# Altium schematic sheet Acoustic recorder.SchDoc
size A3; Organization: University of Manchester; SheetNumber: 1; SheetTotal: 1
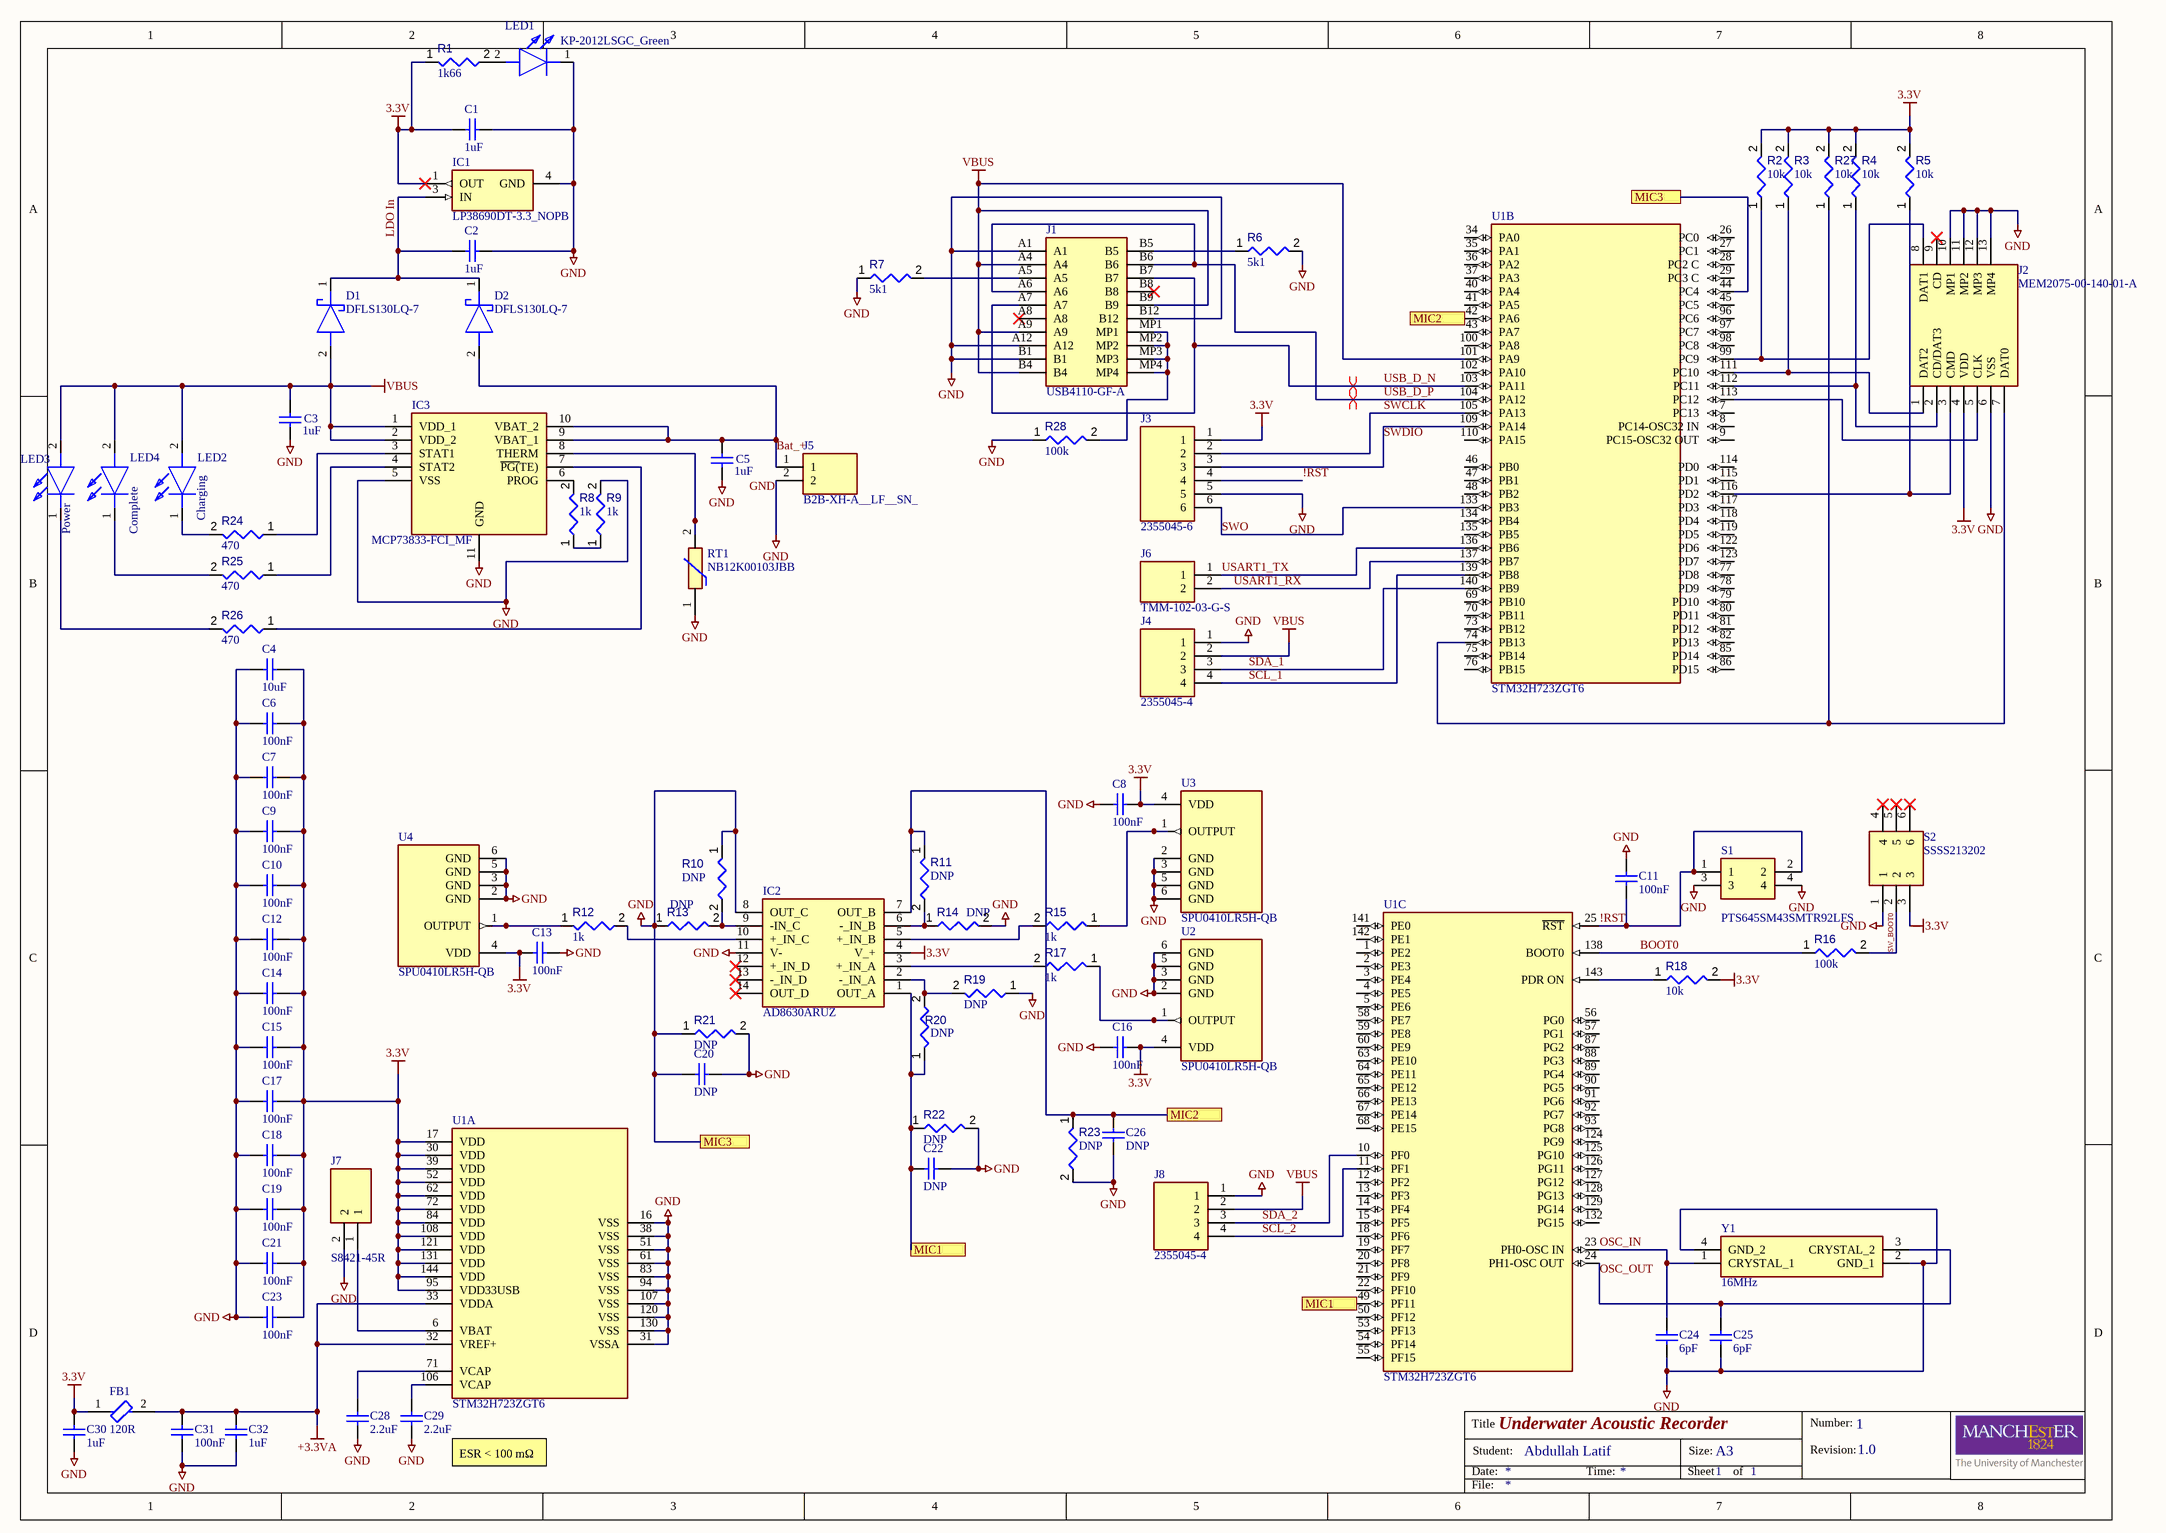
[diagram p0: Acoustic recorder.SchDoc]

## Parts
C1  1uF  [CAPC2013X145X50LL20T25]
C2  1uF  [CAPC2013X145X50LL20T25]
C3  1uF  [CAPC2013X145X50LL20T25]
C4  10uF  [CAPC2013X145X50LL20T25]
C5  1uF  [CAPC2013X145X50LL20T25]
C6  100nF  [CAPC2013X145X50LL20T25]
C7  100nF  [CAPC2013X145X50LL20T25]
C8  100nF  [CAPC2013X145X50LL20T25]
C9  100nF  [CAPC2013X145X50LL20T25]
C10  100nF  [CAPC2013X145X50LL20T25]
C11  100nF  [CAPC2013X145X50LL20T25]
C12  100nF  [CAPC2013X145X50LL20T25]
C13  100nF  [CAPC2013X145X50LL20T25]
C14  100nF  [CAPC2013X145X50LL20T25]
C15  100nF  [CAPC2013X145X50LL20T25]
C16  100nF  [CAPC2013X145X50LL20T25]
C17  100nF  [CAPC2013X145X50LL20T25]
C18  100nF  [CAPC2013X145X50LL20T25]
C19  100nF  [CAPC2013X145X50LL20T25]
C20  DNP  [CAPC2013X145X50LL20T25]
C21  100nF  [CAPC2013X145X50LL20T25]
C22  DNP  [CAPC2013X145X50LL20T25]
C23  100nF  [CAPC2013X145X50LL20T25]
C24  6pF  [CAPC2013X145X50LL20T25]
C25  6pF  [CAPC2013X145X50LL20T25]
C26  DNP  [CAPC2013X145X50LL20T25]
C28  2.2uF  [CAPC2013X145X50LL20T25]
C29  2.2uF  [CAPC2013X145X50LL20T25]
C30  1uF  [CAPC2013X145X50LL20T25]
C31  100nF  [CAPC2013X145X50LL20T25]
C32  1uF  [CAPC2013X145X50LL20T25]
D1  DFLS130LQ-7  [DFLS130LQ7]
D2  DFLS130LQ-7  [DFLS130LQ7]
FB1  120R  [FP-BLM21-0_2-t0_85-e0_5-IPC_A]
IC1  LP38690DT-3.3_NOPB  [TO228P991X238-3N]
IC2  AD8630ARUZ  [SOP65P640X120-14N]
IC3  MCP73833-FCI_MF  [SON50P300X300X100-11N-D]
J1  USB4110-GF-A  [USB4110GFA]
J2  MEM2075-00-140-01-A  [MEM20750014001A]
J3  2355045-6  [HDRV6W50P0X200_1X6_1200X200X550P]
J4  2355045-4  [HDRV4W50P0X200_1X4_800X200X550P]
J5  B2B-XH-A__LF__SN_  [SHDR2W64P0X250_1X2_740X575X700P]
J6  TMM-102-03-G-S  [HDRV2W50P0X200_1X2_400X197X550P]
J7  S8421-45R  [S8421-45R_1]
J8  2355045-4  [HDRV4W50P0X200_1X4_800X200X550P]
LED1  KP-2012LSGC_Green  [LEDC2012X110N]
LED2  Charging  [LEDC2012X110N]
LED3  Power  [LEDC2012X110N]
LED4  Complete  [LEDC2012X110N]
R1  1k66  [RESC2013X50X35ML15T15]
R2  value 10k  [RESC2013X50X35ML15T15]  (hidden comment: Resistor 10k +/-1% 0805 125 mW)
R3  value 10k  [RESC2013X50X35ML15T15]  (hidden comment: Resistor 10k +/-1% 0805 125 mW)
R4  value 10k  [RESC2013X50X35ML15T15]  (hidden comment: Resistor 10k +/-1% 0805 125 mW)
R5  value 10k  [RESC2013X50X35ML15T15]  (hidden comment: Resistor 10k +/-1% 0805 125 mW)
R6  5k1  [RESC2013X50X35ML15T15]
R7  5k1  [RESC2013X50X35ML15T15]
R8  1k  [RESC2013X50X35ML15T15]
R9  1k  [RESC2013X50X35ML15T15]
R10  DNP  [RESC2013X50X35ML15T15]
R11  DNP  [RESC2013X50X35ML15T15]
R12  1k  [RESC2013X50X35ML15T15]
R13  DNP  [RESC2013X50X35ML15T15]
R14  DNP  [RESC2013X50X35ML15T15]
R15  1k  [RESC2013X50X35ML15T15]
R16  100k  [RESC2013X50X35ML15T15]
R17  1k  [RESC2013X50X35ML15T15]
R18  10k  [RESC2013X50X35ML15T15]
R19  DNP  [RESC2013X50X35ML15T15]
R20  DNP  [RESC2013X50X35ML15T15]
R21  DNP  [RESC2013X50X35ML15T15]
R22  DNP  [RESC2013X50X35ML15T15]
R23  DNP  [RESC2013X50X35ML15T15]
R24  value 470  [RESC2013X50X35ML15T15]  (hidden comment: 1k)
R25  value 470  [RESC2013X50X35ML15T15]  (hidden comment: 1k)
R26  value 470  [RESC2013X50X35ML15T15]  (hidden comment: 1k)
R27  value 10k  [RESC2013X50X35ML15T15]  (hidden comment: Resistor 10k +/-1% 0805 125 mW)
R28  100k  [RESC2013X50X35ML15T15]
RT1  NB12K00103JBB  [RESC2212X50N]
S1  PTS645SM43SMTR92LFS  [PTS645(SMT)]
S2  SSSS213202  [SSSS213202]
U1  STM32H723ZGT6  [FP-LQFP144-1A-IPC_A]  (parts A,B,C of 3)
U2  SPU0410LR5H-QB  [XDCR_SPU0410LR5H-QB]
U3  SPU0410LR5H-QB  [XDCR_SPU0410LR5H-QB]
U4  SPU0410LR5H-QB  [XDCR_SPU0410LR5H-QB]
Y1  16MHz  [CX3225SA16000D0PSTZ1]

## Ports
MIC1, MIC2, MIC3

## Nets
3.3V: C1.1 C4.1 C6.1 C7.1 C8.1 C9.1 C10.1 C12.1 C13.1 C14.1 C15.2 C16.1 C17.2 C18.2 C19.2 C21.2 C23.2 C30.2 FB1.1 IC1.1(OUT) IC2.4(V_+) J2.4(VDD) J3.1 R1.1 R2.2 R3.2 R4.2 R5.2 R18.2 R27.2 S2.3 U1.17(VDD) U1.30(VDD) U1.39(VDD) U1.52(VDD) U1.62(VDD) U1.72(VDD) U1.84(VDD) U1.95(VDD33USB) U1.108(VDD) U1.121(VDD) U1.131(VDD) U1.144(VDD) U2.4(VDD) U3.4(VDD) U4.4(VDD)
+3.3VA: C31.2 C32.2 FB1.2 U1.32(VREF+) U1.33(VDDA)
GND: C1.2 C2.2 C3.1 C4.2 C5.1 C6.2 C7.2 C8.2 C9.2 C10.2 C11.2 C12.2 C13.2 C14.2 C15.1 C16.2 C17.1 C18.1 C19.1 C20.1 C20.2 C21.1 C22.2 C23.1 C24.2 C25.1 C26.2 C28.1 C29.1 C30.1 C31.1 C32.1 IC1.4(GND) IC2.8(OUT_C) IC2.11(V-) IC3.5(VSS) IC3.11(GND) J1.A1 J1.A12 J1.B1 J1.B12 J2.6(VSS) J2.10(MP1) J2.11(MP2) J2.12(MP3) J2.13(MP4) J3.5 J4.1 J5.2 J7.2 J8.1 LED1.1(K) R6.2 R7.1 R9.2 R10.1 R13.1 R14.2 R19.1 R21.1 R21.2 R22.2 R23.2 R28.1 RT1.1 S1.3 S1.4 S2.1 U1.16(VSS) U1.31(VSSA) U1.38(VSS) U1.44(PC4) U1.51(VSS) U1.61(VSS) U1.83(VSS) U1.94(VSS) U1.107(VSS) U1.120(VSS) U1.130(VSS) U2.2(GND) U2.3(GND) U2.5(GND) U2.6(GND) U3.2(GND) U3.3(GND) U3.5(GND) U3.6(GND) U4.2(GND) U4.3(GND) U4.5(GND) U4.6(GND) Y1.2(GND_1) Y1.4(GND_2) ; port MIC3
VBUS: C3.2 D1.2(A) IC3.1(VDD_1) IC3.2(VDD_2) J1.A4 J1.A9 J1.B4 J1.B9 J4.2 J8.2 LED2.2(A) LED3.2(A) LED4.2(A) U1.101(PA9)
!RST: C11.1 J3.4 S1.1 S1.2 U1.25(~{RST})
Bat_+: C5.2 D2.2(A) IC3.9(VBAT_1) IC3.10(VBAT_2) J5.1
BOOT0: R16.1 U1.138(BOOT0)
LDO In: C2.1 D1.1(K) D2.1(K) IC1.3(IN)
MIC1: C22.1 IC2.1(OUT_A) R20.1 R22.1 U1.49(PF11) ; port MIC1
MIC2: C26.1 IC2.7(OUT_B) R11.1 R23.1 U1.42(PA6) ; port MIC2
OSC_IN: C24.1 U1.23(PH0-OSC_IN) Y1.1(CRYSTAL_1)
OSC_OUT: C25.2 U1.24(PH1-OSC_OUT) Y1.3(CRYSTAL_2)
SCL_1: J4.4 U1.139(PB8)
SCL_2: J8.4 U1.11(PF1)
SDA_1: J4.3 U1.140(PB9)
SDA_2: J8.3 U1.10(PF0)
SW_BOOT0: R16.2 S2.2
SWCLK: J3.2 U1.105(PA13)
SWDIO: J3.3 U1.109(PA14)
SWO: J3.6 U1.133(PB3)
USART1_RX: J6.2 U1.137(PB7)
USART1_TX: J6.1 U1.136(PB6)
USB_D_N: J1.A7 J1.B7 U1.103(PA11)
USB_D_P: J1.A6 J1.B6 U1.104(PA12)
NetC28_2: C28.2 U1.71(VCAP)
NetC29_2: C29.2 U1.106(VCAP)
NetIC2_2: IC2.2(-_IN_A) R19.2 R20.2
NetIC2_3: IC2.3(+_IN_A) R17.2
NetIC2_5: IC2.5(+_IN_B) R15.2
NetIC2_6: IC2.6(-_IN_B) R11.2 R14.1
NetIC2_9: IC2.9(-IN_C) R10.2 R13.2
NetIC2_10: IC2.10(+_IN_C) R12.2
NetIC3_3: IC3.3(STAT1) R24.1
NetIC3_4: IC3.4(STAT2) R25.1
NetIC3_6: IC3.6(PROG) R8.2
NetIC3_7: IC3.7(~{PG(}TE)) R26.1
NetIC3_8: IC3.8(THERM) RT1.2
NetJ1_A5: J1.A5 R7.2
NetJ1_B5: J1.B5 R6.1
NetJ1_MP1: J1.MP1 J1.MP2 J1.MP3 J1.MP4 R28.2
NetJ2_1: J2.1(DAT2) R3.1 U1.111(PC10)
NetJ2_2: J2.2(CD/DAT3) R4.1 U1.112(PC11)
NetJ2_3: J2.3(CMD) R5.1 U1.116(PD2)
NetJ2_5: J2.5(CLK) U1.113(PC12)
NetJ2_7: J2.7(DAT0) R27.1 U1.74(PB13)
NetJ2_8: J2.8(DAT1) R2.1 U1.99(PC9)
NetJ7_1: J7.1 U1.6(VBAT)
NetLED1_2: LED1.2(A) R1.2
NetLED2_1: LED2.1(K) R24.2
NetLED3_1: LED3.1(K) R26.2
NetLED4_1: LED4.1(K) R25.2
NetR8_1: R8.1 R9.1
NetR12_1: R12.1 U4.1(OUTPUT)
NetR15_1: R15.1 U3.1(OUTPUT)
NetR17_1: R17.1 U2.1(OUTPUT)
NetR18_1: R18.1 U1.143(PDR_ON)

Not connected (* = marked no-connect by the designer): IC2 12(+_IN_D)* 13(-_IN_D)* 14(OUT_D)*; J1 A8* B8*; J2 9(CD)*; S2 4* 5* 6*; U1 1(PE2) 2(PE3) 3(PE4) 4(PE5) 5(PE6) 7(PC13) 8(PC14-OSC32_IN) 9(PC15-OSC32_OUT) 12(PF2) 13(PF3) 14(PF4) 15(PF5) 18(PF6) 19(PF7) 20(PF8) 21(PF9) 22(PF10) 26(PC0) 27(PC1) 28(PC2_C) 29(PC3_C) 34(PA0) 35(PA1) 36(PA2) 37(PA3) 40(PA4) 41(PA5) 43(PA7) 45(PC5) 46(PB0) 47(PB1) 48(PB2) 50(PF12) 53(PF13) 54(PF14) 55(PF15) 56(PG0) 57(PG1) 58(PE7) 59(PE8) 60(PE9) 63(PE10) 64(PE11) 65(PE12) 66(PE13) 67(PE14) 68(PE15) 69(PB10) 70(PB11) 73(PB12) 75(PB14) 76(PB15) 77(PD8) 78(PD9) 79(PD10) 80(PD11) 81(PD12) 82(PD13) 85(PD14) 86(PD15) 87(PG2) 88(PG3) 89(PG4) 90(PG5) 91(PG6) 92(PG7) 93(PG8) 96(PC6) 97(PC7) 98(PC8) 100(PA8) 102(PA10) 110(PA15) 114(PD0) 115(PD1) 117(PD3) 118(PD4) 119(PD5) 122(PD6) 123(PD7) 124(PG9) 125(PG10) 126(PG11) 127(PG12) 128(PG13) 129(PG14) 132(PG15) 134(PB4) 135(PB5) 141(PE0) 142(PE1)

## Layout directives
differential pair: USB_D_N, USB_D_P

## Notes on the sheet
- ESR < 100 mΩ
- Title
- Date:
- Student:
- Underwater Acoustic Recorder
- Abdullah Latif
- Time:
- Sheet
- Size:
- A3
- of
- Revision:
- Number:
- 1
- 1.0
- File:
- Labels drawn without touching a wire or pin: GND

## Library data of the parts
C1-C26 C28-C32 = CMP-1036-04391-2: Manufacturer: Kemet; Part Number: C0805C104K9RACTU
D1 D2 = DFLS130LQ-7: Schottky Diode; Manufacturer_Name: Diodes Inc.; Datasheet Link: https://www.diodes.com/assets/Datasheets/DFLS130LQ.pdf; Height: 1mm; Manufacturer_Part_Number: DFLS130LQ-7; Mouser Part Number: 621-DFLS130LQ7; Mouser Price/Stock: https://www.mouser.co.uk/ProductDetail/Diodes-Incorporated/DFLS130LQ-7?qs=vkMqrgFpRahNwl6S9aozvQ%3D%3D; Arrow Part Number: DFLS130LQ-7; Arrow Price/Stock: https://www.arrow.com/en/products/dfls130lq-7/diodes-incorporated?region=nac
FB1 = CMP-0686-00716-3: FERRITE BEAD 120 OHM 0805 1LN; Number of Lines: 1; DC Resistance-Max: 100mR; Material: Steel; Max DC Current: 200mA; Shielding: Unshielded; Test Frequency: 100MHz; Current Rating: 800mA; Max Current Rating: 1A; Resistance: 150mR; Tolerance: 25%; Width: 1.25mm; Number of Circuits: 1; Military Standard: Not; Height: 0.85mm; Series: BLM21A; Min Operating Temperature: -55°C; DC Resistance (DCR): 100mR; Termination: SMD/SMT; Impedance: 120R; Core Material: Ferrite; REACH SVHC: No SVHC; Radiation Hardening: No; Max Operating Temperature: 125°C; Number of Pins: 2; Case/Package: 0805; Case Code (Imperial): 0805; Frequency: 100MHz; Depth: 1.25mm; Length: 2mm; DC Current: 200mA; Lead Free: Lead Free; Case Code (Metric): 2012; Package Quantity: 1; Packaging: Tape and Reel
IC1 = LP38690DT-3.3_NOPB: Integrated Circuit; Manufacturer_Name: Texas Instruments; Manufacturer_Part_Number: LP38690DT-3.3/NOPB; Datasheet Link: http://www.ti.com/lit/ds/symlink/lp38690.pdf; Height: 2.38mm; Mouser Part Number: 926-38690DT-3.3/NOPB; Mouser Price/Stock: https://www.mouser.co.uk/ProductDetail/Texas-Instruments/LP38690DT-3.3-NOPB?qs=1FNqv8aZn1RDCTlgvtVtOw%3D%3D; Arrow Part Number: LP38690DT-3.3/NOPB; Arrow Price/Stock: https://www.arrow.com/en/products/lp38690dt-3.3nopb/texas-instruments?region=nac
IC2 = AD8630ARUZ: Integrated Circuit; Manufacturer_Name: Analog Devices; Datasheet Link: https://datasheet.datasheetarchive.com/originals/distributors/Datasheets-4/DSA-69692.pdf; Height: 1.2mm; Manufacturer_Part_Number: AD8630ARUZ; Mouser Part Number: 584-AD8630ARUZ; Mouser Price/Stock: https://www.mouser.co.uk/ProductDetail/Analog-Devices/AD8630ARUZ?qs=%2FtpEQrCGXCy30ZKDJ2UEnQ%3D%3D; Arrow Part Number: AD8630ARUZ; Arrow Price/Stock: https://www.arrow.com/en/products/ad8630aruz/analog-devices?region=nac
IC3 = MCP73833-FCI_MF: Integrated Circuit; Manufacturer_Name: Microchip; Manufacturer_Part_Number: MCP73833-FCI/MF; Datasheet Link: https://datasheet.datasheetarchive.com/originals/distributors/SFDatasheet-4/sf-00090109.pdf; Height: 1mm; Mouser Part Number: 579-MCP73833-FCI/MF; Mouser Price/Stock: https://www.mouser.co.uk/ProductDetail/Microchip-Technology/MCP73833-FCI-MF?qs=jZi1jxfVU97QRtF2cSv2tQ%3D%3D; Arrow Part Number: MCP73833-FCI/MF; Arrow Price/Stock: https://www.arrow.com/en/products/mcp73833-fcimf/microchip-technology?region=nac
J1 = USB4110-GF-A: Connector; Manufacturer_Name: GCT (GLOBAL CONNECTOR TECHNOLOGY); Datasheet Link: https://gct.co/files/drawings/usb4110.pdf; Height: 3.26mm; Manufacturer_Part_Number: USB4110-GF-A; Mouser Part Number: 640-USB4110-GF-A; Mouser Price/Stock: https://www.mouser.co.uk/ProductDetail/GCT/USB4110-GF-A?qs=KUoIvG%2F9IlYiZvIXQjyJeA%3D%3D
J2 = MEM2075-00-140-01-A: Connector; Manufacturer_Name: GCT (GLOBAL CONNECTOR TECHNOLOGY); Datasheet Link: http://www.farnell.com/cad/2606866.pdf; Manufacturer_Part_Number: MEM2075-00-140-01-A; Mouser Part Number: 640-MEM20750014001A; Mouser Price/Stock: https://www.mouser.co.uk/ProductDetail/GCT/MEM2075-00-140-01-A?qs=KUoIvG%2F9IlZvfWpeERlq3Q%3D%3D
J3 = 2355045-6: Connector; Manufacturer_Name: TE Connectivity; Datasheet Link: https://www.te.com/commerce/DocumentDelivery/DDEController?Action=showdoc&DocId=Customer+Drawing%7F2355045%7FA%7Fpdf%7FEnglish%7FENG_CD_2355045_A.pdf%7F2355045-6; Height: 5.5mm; Manufacturer_Part_Number: 2355045-6; Mouser Part Number: 571-2355045-6; Mouser Price/Stock: https://www.mouser.co.uk/ProductDetail/TE-Connectivity/2355045-6?qs=Cb2nCFKsA8odbib%252BLADOfw%3D%3D; Arrow Part Number: 2355045-6; Arrow Price/Stock: https://www.arrow.com/en/products/2355045-6/te-connectivity?region=nac
J4 J8 = 2355045-4: Connector; Manufacturer_Name: TE Connectivity; Datasheet Link: https://www.te.com/commerce/DocumentDelivery/DDEController?Action=srchrtrv&DocNm=2355045&DocType=Customer+Drawing&DocLang=English&PartCntxt=2355045-4&DocFormat=pdf; Height: 5.5mm; Manufacturer_Part_Number: 2355045-4; Mouser Part Number: 571-2355045-4; Mouser Price/Stock: https://www.mouser.co.uk/ProductDetail/TE-Connectivity/2355045-4?qs=Cb2nCFKsA8pf%2FHFl8Qaczg%3D%3D; Arrow Part Number: 2355045-4; Arrow Price/Stock: https://www.arrow.com/en/products/2355045-4/te-connectivity?region=nac
J5 = B2B-XH-A__LF__SN_: Connector; Manufacturer_Name: JST (JAPAN SOLDERLESS TERMINALS); Manufacturer_Part_Number: B2B-XH-A (LF)(SN); Datasheet Link: http://www.farnell.com/datasheets/5448.pdf; Height: 7mm
J6 = TMM-102-03-G-S: Connector; Manufacturer_Name: SAMTEC; Datasheet Link: https://www.arrow.com/en/products/tmm-102-03-g-s/samtec; Height: 5.5mm; Manufacturer_Part_Number: TMM-102-03-G-S; Mouser Part Number: 200-TMM10203GS; Mouser Price/Stock: https://www.mouser.co.uk/ProductDetail/Samtec/TMM-102-03-G-S?qs=iT52DjcXudtI9IbXWd2erQ%3D%3D; Arrow Part Number: TMM-102-03-G-S; Arrow Price/Stock: https://www.arrow.com/en/products/tmm-102-03-g-s/samtec
J7 = S8421-45R: Connector; Manufacturer_Name: Harwin; Datasheet Link: https://cdn.harwin.com/pdfs/S8421R.pdf; Manufacturer_Part_Number: S8421-45R; Mouser Part Number: 855-S8421-45R; Mouser Price/Stock: https://www.mouser.co.uk/ProductDetail/Harwin/S8421-45R?qs=Qom7kyPojXY6z0Gmx3V3RQ%3D%3D
LED1-LED4 = KP-2012LSGC: LED; Manufacturer_Name: Kingbright; Datasheet Link: http://www.farnell.com/datasheets/1854080.pdf; Height: 1.1mm; Manufacturer_Part_Number: KP-2012LSGC; Mouser Part Number: N/A; Mouser Price/Stock: https://www.mouser.co.uk/ProductDetail/Kingbright/KP-2012LSGC?qs=8qEfIxKlfRkgZx2Txwq0qw%3D%3D; Arrow Part Number: KP-2012LSGC; Arrow Price/Stock: https://www.arrow.com/en/products/kp-2012lsgc/kingbright?region=europe
R1 R6-R9 R12 R15-R18 R24-R26 R28 = CMP-009-00018-5: Tolerance: 1%; Power: 125mW; Voltage Rating: 150V; Pins: 2; Min Operating Temperature: -55°C; Case/Package: 0805; Max Operating Temperature: 155°C; RoHS Compliant: True; Mounting Technology: SM
  R1: Value: 1k66
  R6 R7: Value: 5k1
  R8 R9 R12 R15 R17: Value: 1k
  R16 R28: Value: 100k
  R18: Value: 10k
R2-R5 R27 = CMP-009-00018-5: Chip Resistor, 10 KOhm, +/- 1%, 125 mW, -55 to 155 degC, 0805 (2012 Metric); Power: 125mW; Voltage Rating: 150V; Tolerance: 1%; Pins: 2; Min Operating Temperature: -55°C; Case/Package: 0805; Max Operating Temperature: 155°C; RoHS Compliant: True; Mounting Technology: SM
R10 R11 R20 = CMP-009-00018-5: 2k1; Tolerance: 1%; Power: 125mW; Voltage Rating: 150V; Pins: 2; Min Operating Temperature: -55°C; Case/Package: 0805; Max Operating Temperature: 155°C; RoHS Compliant: True; Value: DNP; Mounting Technology: SM
R13 R14 R19 = CMP-009-00018-5: 1k2; Tolerance: 1%; Power: 125mW; Voltage Rating: 150V; Pins: 2; Min Operating Temperature: -55°C; Case/Package: 0805; Max Operating Temperature: 155°C; RoHS Compliant: True; Value: DNP; Mounting Technology: SM
R21-R23 = CMP-009-00018-5: 100k; Tolerance: 1%; Power: 125mW; Voltage Rating: 150V; Pins: 2; Min Operating Temperature: -55°C; Case/Package: 0805; Max Operating Temperature: 155°C; RoHS Compliant: True; Value: DNP; Mounting Technology: SM
RT1 = NB12K00103JBB: Thermistor; Manufacturer_Name: AVX; Datasheet Link: https://datasheet.datasheetarchive.com/originals/distributors/Datasheets-DGA6/551314.pdf; Height: 0.5mm; Manufacturer_Part_Number: NB12K00103JBB; Mouser Part Number: 581-NB12K00103JBB; Mouser Price/Stock: https://www.mouser.co.uk/ProductDetail/AVX/NB12K00103JBB/?qs=4%252B6%252BTdINQeDPvI%252BQUQjJ3Q%3D%3D; Arrow Part Number: NB12K00103JBB; Arrow Price/Stock: https://www.arrow.com/en/products/nb12k00103jbb/avx
S1 = PTS645SM43SMTR92LFS: Switch; Manufacturer_Name: C & K COMPONENTS; Datasheet Link: https://www.ckswitches.com/media/1471/pts645.pdf; Manufacturer_Part_Number: PTS645SM43SMTR92LFS; Mouser Part Number: 611-PTS645SM43SMTR92; Mouser Price/Stock: https://www.mouser.co.uk/ProductDetail/CK/PTS645SM43SMTR92LFS?qs=FESYatJ8odKPktxv6ncfWg%3D%3D; Arrow Part Number: PTS645SM43SMTR92LFS; Arrow Price/Stock: https://www.arrow.com/en/products/pts645sm43smtr92lfs/ck
S2 = SSSS213202: Switch; Manufacturer_Name: ALPS Electric; Datasheet Link: http://www.alps.com/prod/info/E/HTML/Switch/Slide/SSSS2/SSSS213202.html#Land Dimensions; Manufacturer_Part_Number: SSSS213202; Mouser Part Number: 688-SSSS213202; Mouser Price/Stock: https://www.mouser.co.uk/ProductDetail/Alps-Alpine/SSSS213202?qs=6EGMNY9ZYDRKFJ9qebDCNQ%3D%3D
U1 = CMP-12105-000148-1: IC MCU 32BIT 1MB FLASH 144LQFP
U2-U4 = SPU0410LR5H-QB: 100Hz ~ 80kHz Analog Microphone MEMS _Silicon_ 1.5V ~ 3.6V Omnidirectional _-38dB Â±3dB @ 94dB SPL_ Solder Pads; MF: Knowles; Price: None; Value: *; Package: 2010 Knowles Acoustics; SnapEDA_Link: https://www.snapeda.com/parts/SPU0410LR5H-QB/Knowles/view-part/48340/?ref=snap; MP: SPU0410LR5H-QB; Availability: Unavailable
Y1 = CX3225SA16000D0PSTZ1: Crystal or Oscillator; Manufacturer_Name: KYOCERA; Datasheet Link: https://ele.kyocera.com/assets/products/crystal-device/cx3225sa_e.pdf; Height: 0.8mm; Manufacturer_Part_Number: CX3225SA16000D0PSTZ1; Mouser Part Number: 581-CX3225SA16D0PST; Mouser Price/Stock: https://www.mouser.co.uk/ProductDetail/KYOCERA-AVX/CX3225SA16000D0PSTZ1?qs=DN1kgsm7Y2SRgzHPt1S5hg%3D%3D